# Altium schematic sheet USB-I2C_Schematic.SchDoc: USB-I2C
size 420 x 297 mm; ApprovedBy: Рогов; CheckedBy: Королев Д.М.; DrawnBy: Тришин В.М.; DocumentNumber: Введите номер платы + Э3; SheetTotal: 1; DocumentType: Электрическая принципиальная; Format: A3; ImagePath: Введите номер платы
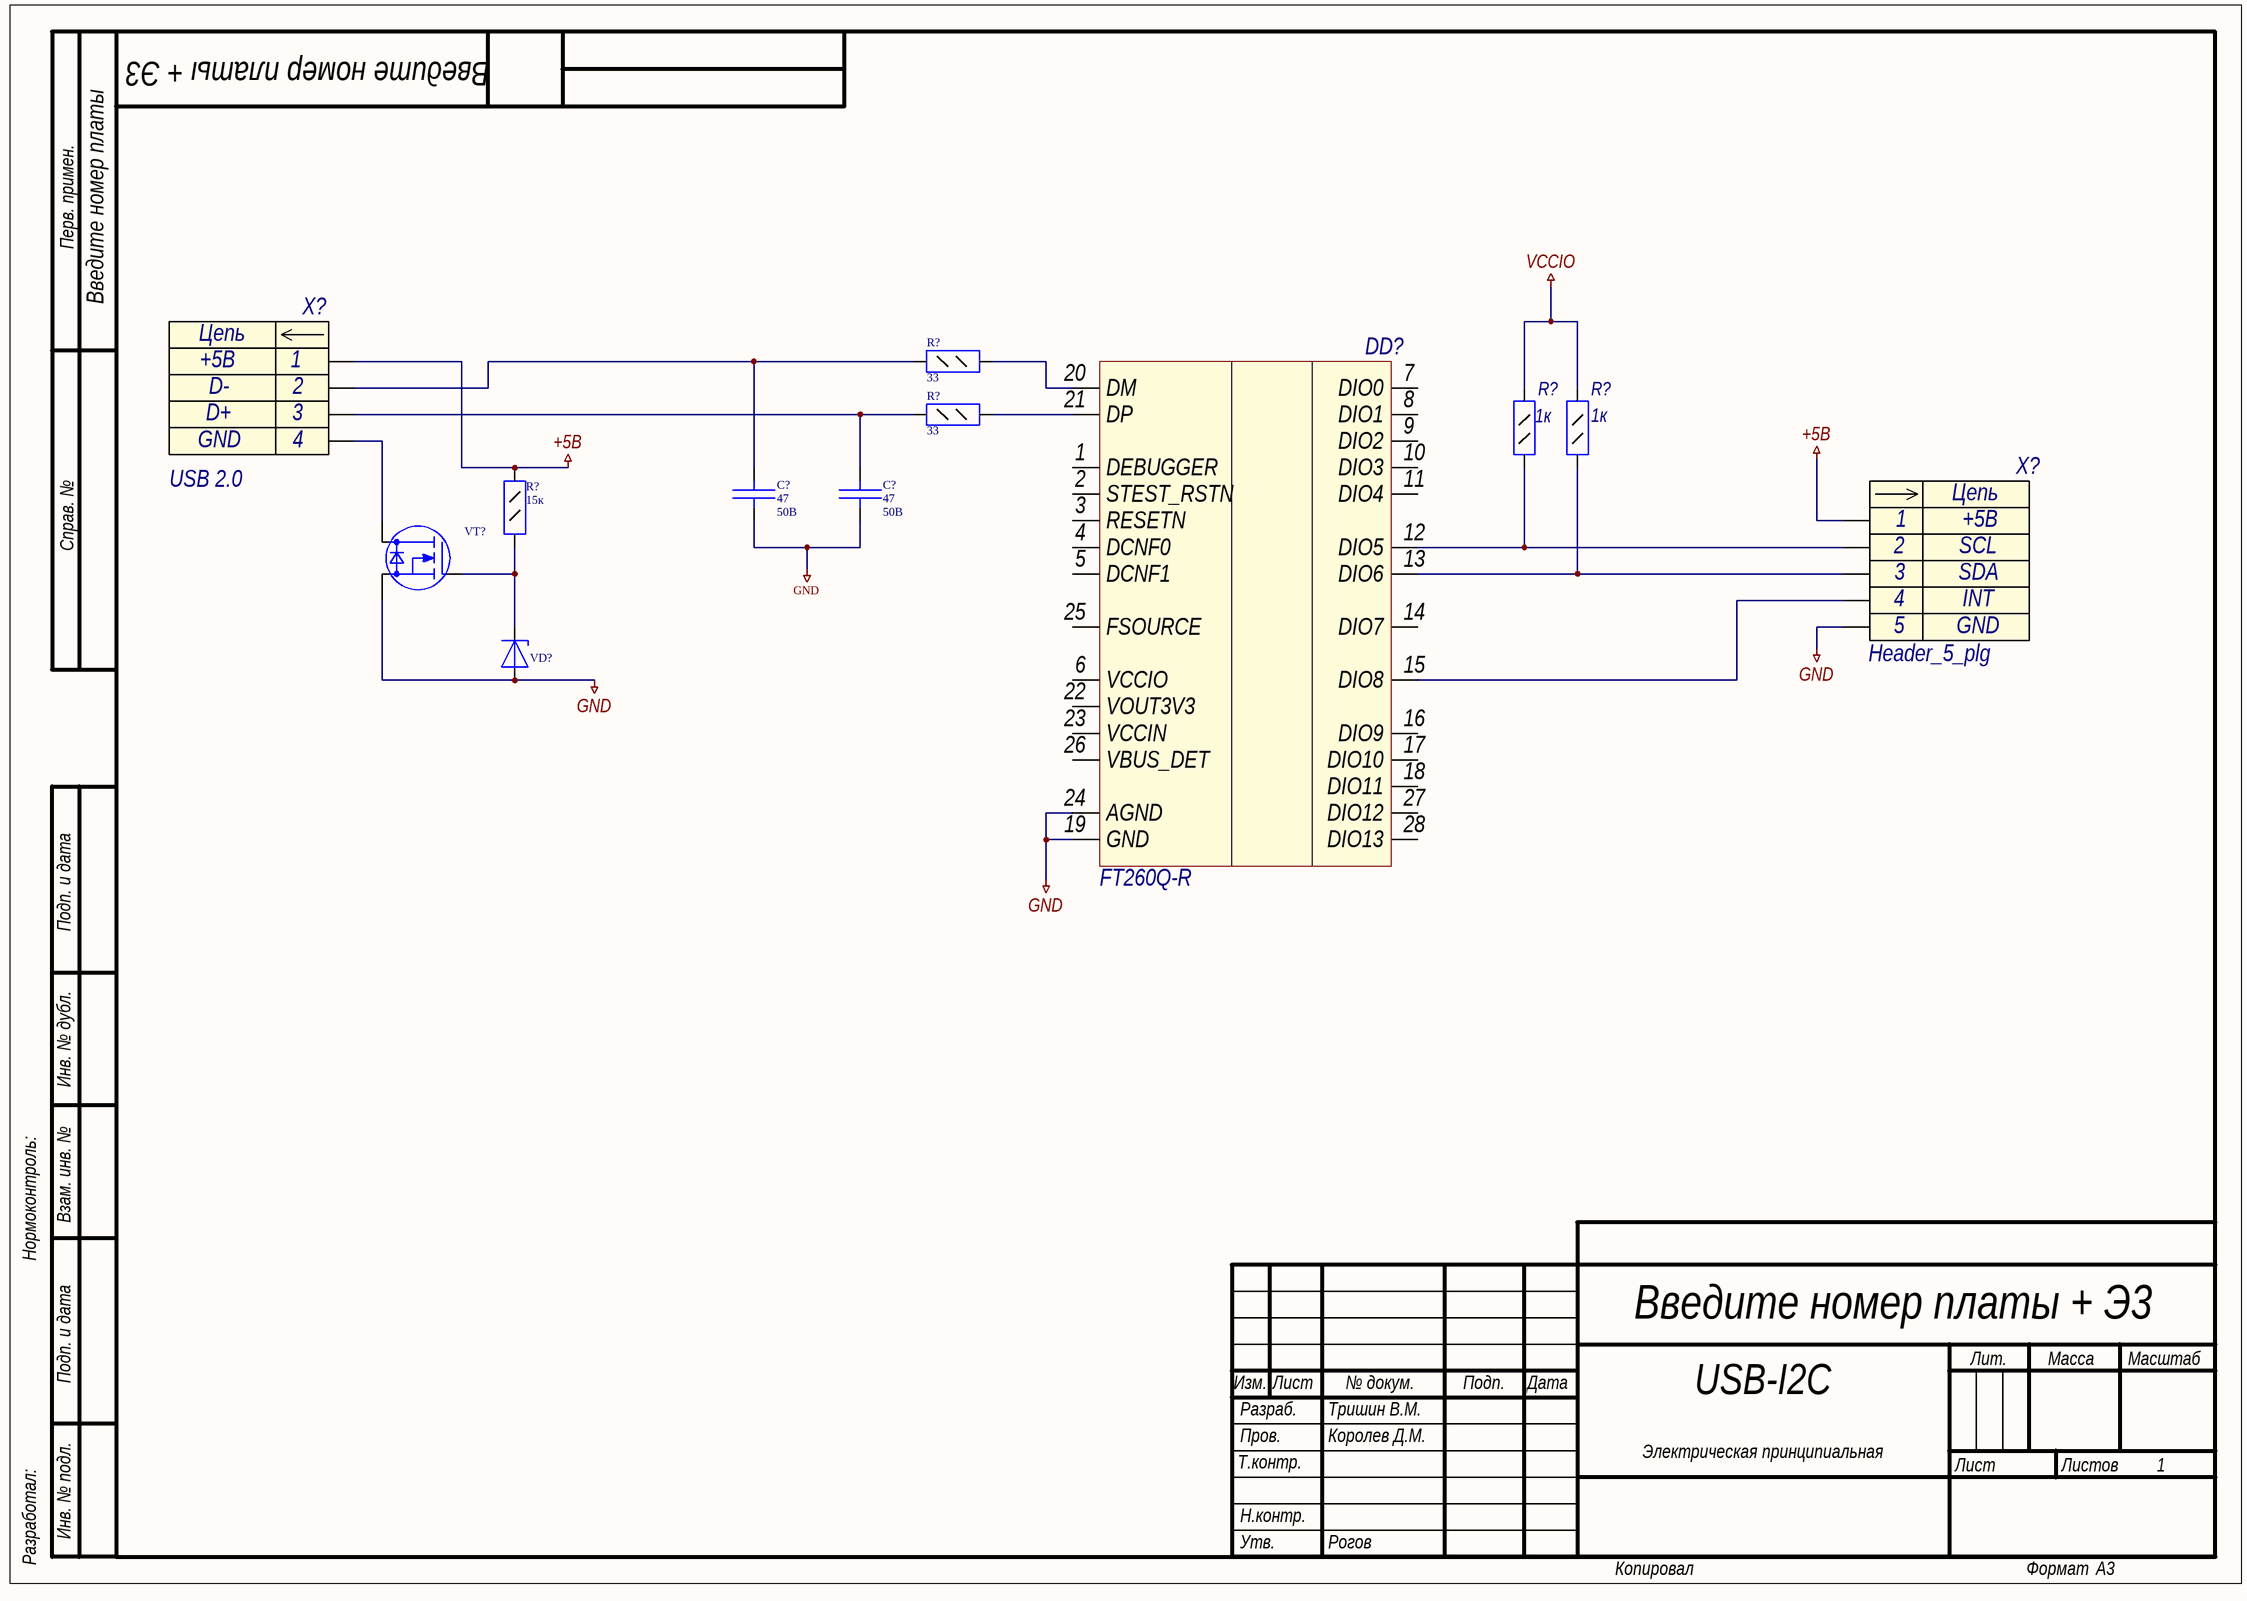
[diagram p0: USB-I2C_Schematic.SchDoc]

## Parts
(Parts that share a designator on the sheet are numbered #1, #2 ... from top to bottom, then left to right.)
C?#1  value 47  Voltage: 50B  [C0402]  (hidden comment: Capacitor)
C?#2  value 47  Voltage: 50B  [C0402]  (hidden comment: Capacitor)
DD?  FT260Q-R
R?#1  value 33  [R0805]  (hidden comment: Resistor_0,125Вт)
R?#2  value 33  [R0805]  (hidden comment: Resistor_0,125Вт)
R?#3  value 15к  [R0805]  (hidden comment: Resistor_0,125Вт)
R?#4  value 1к  [R0805]  (hidden comment: Resistor_0,125Вт)
R?#5  value 1к  [R0805]  (hidden comment: Resistor_0,125Вт)
VD?  DiodeZener  [SMA]  (value not drawn)
VT?  N-MOSFET  [SOT23-3]  (value not drawn)
X?#1  USB 2.0  [PLS-4]
X?#2  Header_5_plg  [PLS-5]

## Nets
+5В: R?#3.1 X?#1.1 X?#2.1
GND: C?#1.1 C?#2.1 DD?.19(GND) DD?.24(AGND) VD?.2(A) VT?.2(S) X?#2.5
VCCIO: R?#4.2 R?#5.2
NetC?#1_2: C?#1.2 R?#1.1 X?#1.2
NetC?#2_2: C?#2.2 R?#2.1 X?#1.3
NetDD?_12: DD?.12(DIO5) R?#4.1 X?#2.2
NetDD?_13: DD?.13(DIO6) R?#5.1 X?#2.3
NetDD?_15: DD?.15(DIO8) X?#2.4
NetDD?_20: DD?.20(DM) R?#1.2
NetDD?_21: DD?.21(DP) R?#2.2
NetR?#3_2: R?#3.2 VD?.1(K) VT?.1(G)
NetVT?_3: VT?.3(D) X?#1.4

Not connected (* = marked no-connect by the designer): DD? 1(DEBUGGER) 2(STEST_RSTN) 3(RESETN) 4(DCNF0) 5(DCNF1) 6(VCCIO) 7(DIO0) 8(DIO1) 9(DIO2) 10(DIO3) 11(DIO4) 14(DIO7) 16(DIO9) 17(DIO10) 18(DIO11) 22(VOUT3V3) 23(VCCIN) 25(FSOURCE) 26(VBUS_DET) 27(DIO12) 28(DIO13)

## Notes on the sheet
- Перв. примен.
- Справ. №
- Подп. и дата
- Инв. № дубл.
- Нормоконтроль:
- Взам. инв. №
- Изм.
- Лист
- № докум.
- Подп.
- Дата
- Лит.
- Масса
- Масштаб
- Т.контр.
- Пров.
- Разраб.
- Листов
- Разработал:
- Инв. № подл.
- Н.контр.
- Утв.
- Копировал
- Формат
- (in symbol connect6) Цепь
- (in symbol connect14) Цепь

## Library data of the parts
C?#1 C?#2 = cap14: Конденсатор; Part Name: Capacitors; Part Number: GRM1555C1H470J; id: cap14; TKE: NP0
DD? = FT260Q-R: IC BRIDGE USB TO UART/I2C 28WQFN; Manufacture: FTDI, Future Technology Devices International Ltd; Model: FT260Q-R; Case: 28-WQFN (5x5); HelpURL: https://www.digikey.com/product-detail/en/ftdi-future-technology-devices-international-ltd/FT260Q-R/FT260Q-RTR-ND/5956531
R?#1 R?#2 = res37: Резистор; id: res37; Accuracy: 1%; Part Name: Resistor; Power: 0,125Вт
R?#3 = res101: Резистор; id: res101; Accuracy: 1%; Part Name: Resistor; Power: 0,125Вт
R?#4 R?#5 = res73: Резистор; id: res73; Accuracy: 1%; Part Name: Resistor; Power: 0,125Вт
VD? = diode0: Стабилитрон; Part Name: TVS diode; Part Number: SMAJ5.0A-TR; Manufacture: ST Microelectronics; id: diode0; Breakdown Voltage: 6,74B; Breakdown Current: 10mA; Leakage current: 20uA; Leakage voltage: 5B
VT? = trans2: Part Name: Transistor; Part Number: IRLML2402TRPBF; Manufacturer: International Rectifier; id: trans2; Structure: n-channel; V drain-source max: 20B; Rds: 0,25Ohm; Gate-to-source voltage: (+-)12B; Continuous drain current: 1,2A; Pulsed drain current: 7,4A; Power dissipation: 0,54W
X?#1 = connect14: Разъем - 4 конт. вилка; Part Number: DS1021-1*4SF112-B; Manufacture: Ningbo connfly electronic; Contact_1: +5В; Contact_2: D-; Contact_3: D+; Contact_4: GND; Etch: 2,54mm; Part Name: PLS-4; id: connect14
X?#2 = connect6: Разъем - 5 конт. вилка; Part Number: DS1021-1*5SF112-B; Manufacture: Ningbo connfly electronic; Contact_1: +5В; Contact_2: SCL; Contact_3: SDA; Contact_4: INT; Contact_5: GND; Etch: 2,54mm; Part Name: PLS-5; id: connect6